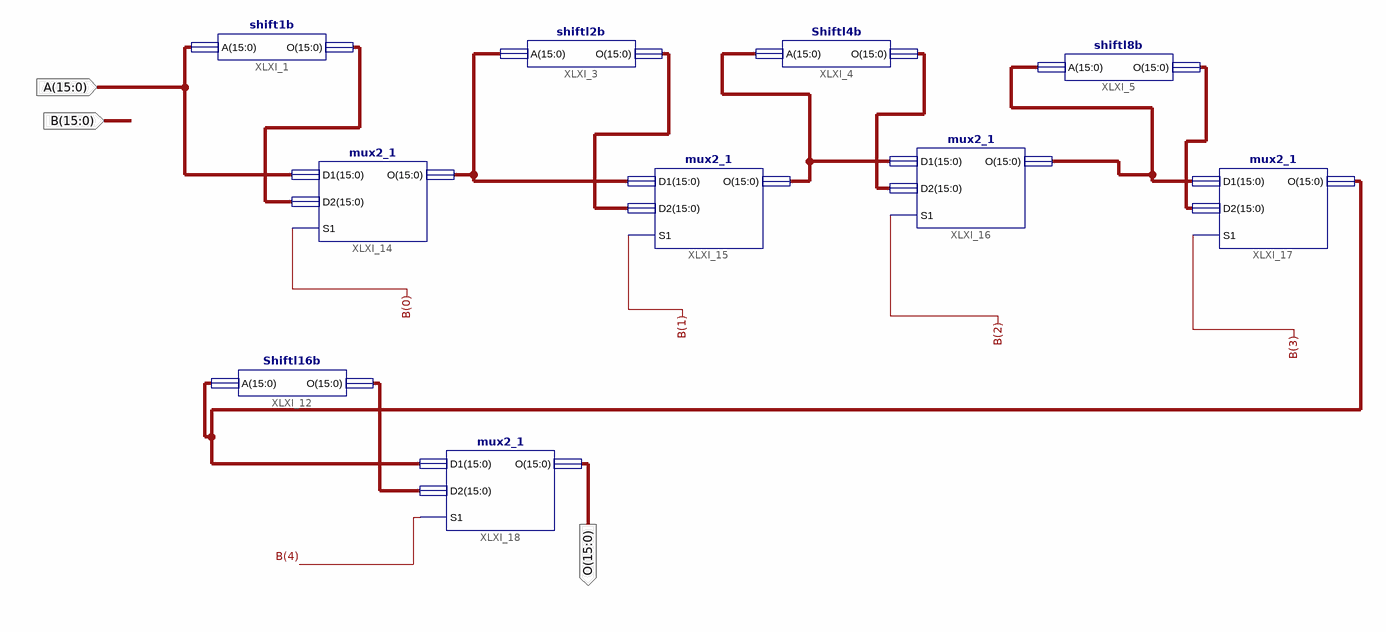
[diagram p0: schematic sheet 1]
// Xilinx ISE schematic ShiftLeft.sch (spartan3e) as structural Verilog: 10 symbols, 3 ports
module ShiftLeft (
  input  [15:0] A,
  input  [15:0] B,
  output [15:0] O
);

  wire [15:0] XLXN_12, XLXN_19, XLXN_23, XLXN_25, XLXN_28, XLXN_31, XLXN_36, XLXN_38, XLXN_40;

  shift1b XLXI_1 (.A(A), .O(XLXN_19));
  shiftl2b XLXI_3 (.A(XLXN_40), .O(XLXN_25));
  shiftl8b XLXI_5 (.A(XLXN_31), .O(XLXN_12));
  Shiftl4b XLXI_4 (.A(XLXN_23), .O(XLXN_28));
  Shiftl16b XLXI_12 (.A(XLXN_36), .O(XLXN_38));
  mux2_1 XLXI_14 (.D1(A), .D2(XLXN_19), .S1(B[0]), .O(XLXN_40));
  mux2_1 XLXI_15 (.D1(XLXN_40), .D2(XLXN_25), .S1(B[1]), .O(XLXN_23));
  mux2_1 XLXI_16 (.D1(XLXN_23), .D2(XLXN_28), .S1(B[2]), .O(XLXN_31));
  mux2_1 XLXI_17 (.D1(XLXN_31), .D2(XLXN_12), .S1(B[3]), .O(XLXN_36));
  mux2_1 XLXI_18 (.D1(XLXN_36), .D2(XLXN_38), .S1(B[4]), .O(O));
endmodule
